# Altium project 14-StepMotor.PrjPcb
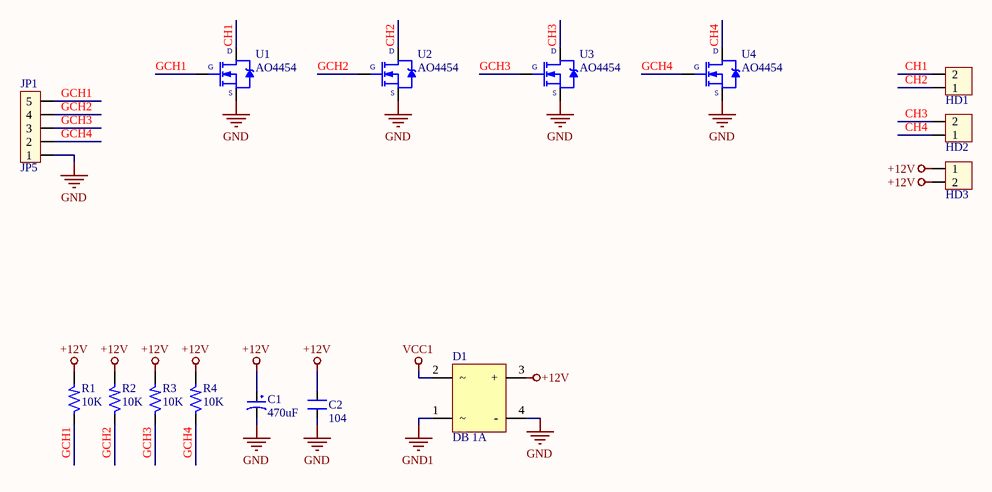
[diagram p0: 14-StepMotor.SchDoc]
1 sheet, 15 parts. Net scope: global (net labels, ports and power ports of the same name join across sheets).
Board file: 14-StepMotor.PcbDoc

## Sheet 14-StepMotor.SchDoc
size A4

### Parts
C1  470uF  [C-ALU-D6.5]
C2  104  [C-0805]
D1  DB 1A  [D-DB-1A-SMD]
HD1  CH1  [TER-KF301-2]  (value not drawn)
HD2  CH1  [TER-KF301-2]  (value not drawn)
HD3  CH1  [TER-KF301-2]  (value not drawn)
JP1  JP5  [JP5]
R1  10K  [R-0805]
R2  10K  [R-0805]
R3  10K  [R-0805]
R4  10K  [R-0805]
U1  AO4454  [TO-252]
U2  AO4454  [TO-252]
U3  AO4454  [TO-252]
U4  AO4454  [TO-252]

### Nets
+12V: C1.1 C2.2 D1.3(+) HD3.1 HD3.2 R1.2 R2.2 R3.2 R4.2
GND: C1.2 C2.1 D1.4(-) JP1.1 U1.3(S) U2.3(S) U3.3(S) U4.3(S)
GND1: D1.1
VCC1: D1.2
CH1: HD1.2 U1.2(D)
CH2: HD1.1 U2.2(D)
CH3: HD2.2 U3.2(D)
CH4: HD2.1 U4.2(D)
GCH1: JP1.5 R1.1 U1.1(G)
GCH2: JP1.4 R2.1 U2.1(G)
GCH3: JP1.3 R3.1 U3.1(G)
GCH4: JP1.2 R4.1 U4.1(G)

### Library data of the parts
C1 = CP1: Cap P  0,1uF < 22uF , 16 - 50V; Value: 10uF/50V; Description 1: 10 => 220uF/6,3V/10V - 10uF => 100uF/16V; Description 2: 0,1uF => 33uF/50V - 10uF => 22uF/63V; Description 3: 0,47uF => 10uF/100V
C2 = CN: Value: 0,1uF/300V; Designed by: VanDungEvn
D1 = DB
HD1-HD3 = Hed2: Header 2 (Green); Value: Header 2
R1-R4 = R: Resistor 1/4W; Value: R1/4W - 1K
U1-U4 = AO4454: Value: AO4454